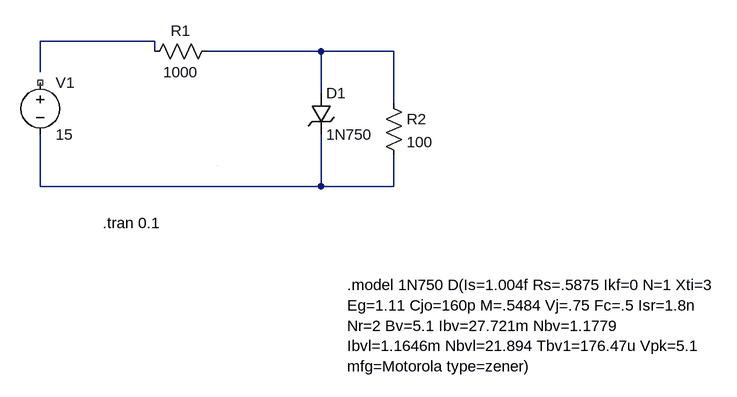
[diagram p0: schematic lab5.asc]
lab5.asc, the LTspice schematic file:
Version 4
SHEET 1 880 680
WIRE -96 -192 -272 -192
WIRE -96 -176 -96 -192
WIRE 160 -176 -16 -176
WIRE 272 -176 160 -176
WIRE -272 -144 -272 -192
WIRE 160 -112 160 -176
WIRE 272 -96 272 -176
WIRE -272 32 -272 -48
WIRE 160 32 160 -48
WIRE 160 32 -272 32
WIRE 272 32 272 -16
WIRE 272 32 160 32
WIRE 0 0 0 0
SYMBOL voltage -272 -144 R0
WINDOW 123 0 0 Left 0
WINDOW 39 0 0 Left 0
SYMATTR InstName V1
SYMATTR Value 15
SYMBOL res 0 -192 R90
WINDOW 0 0 56 VBottom 2
WINDOW 3 32 56 VTop 2
SYMATTR InstName R1
SYMATTR Value 1000
SYMBOL zener 144 -112 R0
SYMATTR InstName D1
SYMATTR Value 1N750
SYMBOL res 256 -112 R0
SYMATTR InstName R2
SYMATTR Value 100
TEXT 200 184 Left 2 !.model 1N750 D(Is=1.004f Rs=.5875 Ikf=0 N=1 Xti=3\nEg=1.11 Cjo=160p M=.5484 Vj=.75 Fc=.5 Isr=1.8n\nNr=2 Bv=5.1 Ibv=27.721m Nbv=1.1779\nIbvl=1.1646m Nbvl=21.894 Tbv1=176.47u Vpk=5.1\nmfg=Motorola type=zener)
TEXT -176 88 Left 2 !.tran 0.1

The netlist it stands for:
* lab5.asc
V1 NC_01 N003 15
R1 N002 N001 1000
D1 N002 N003 1N750
R2 N002 N003 100
.model D D
.lib standard.dio
.model 1N750 D(Is=1.004f Rs=.5875 Ikf=0 N=1 Xti=3
Eg=1.11 Cjo=160p M=.5484 Vj=.75 Fc=.5 Isr=1.8n
Nr=2 Bv=5.1 Ibv=27.721m Nbv=1.1779
Ibvl=1.1646m Nbvl=21.894 Tbv1=176.47u Vpk=5.1
mfg=Motorola type=zener)
.tran 0.1
.backanno
.end